# Altium project Main Controller.PrjPcb
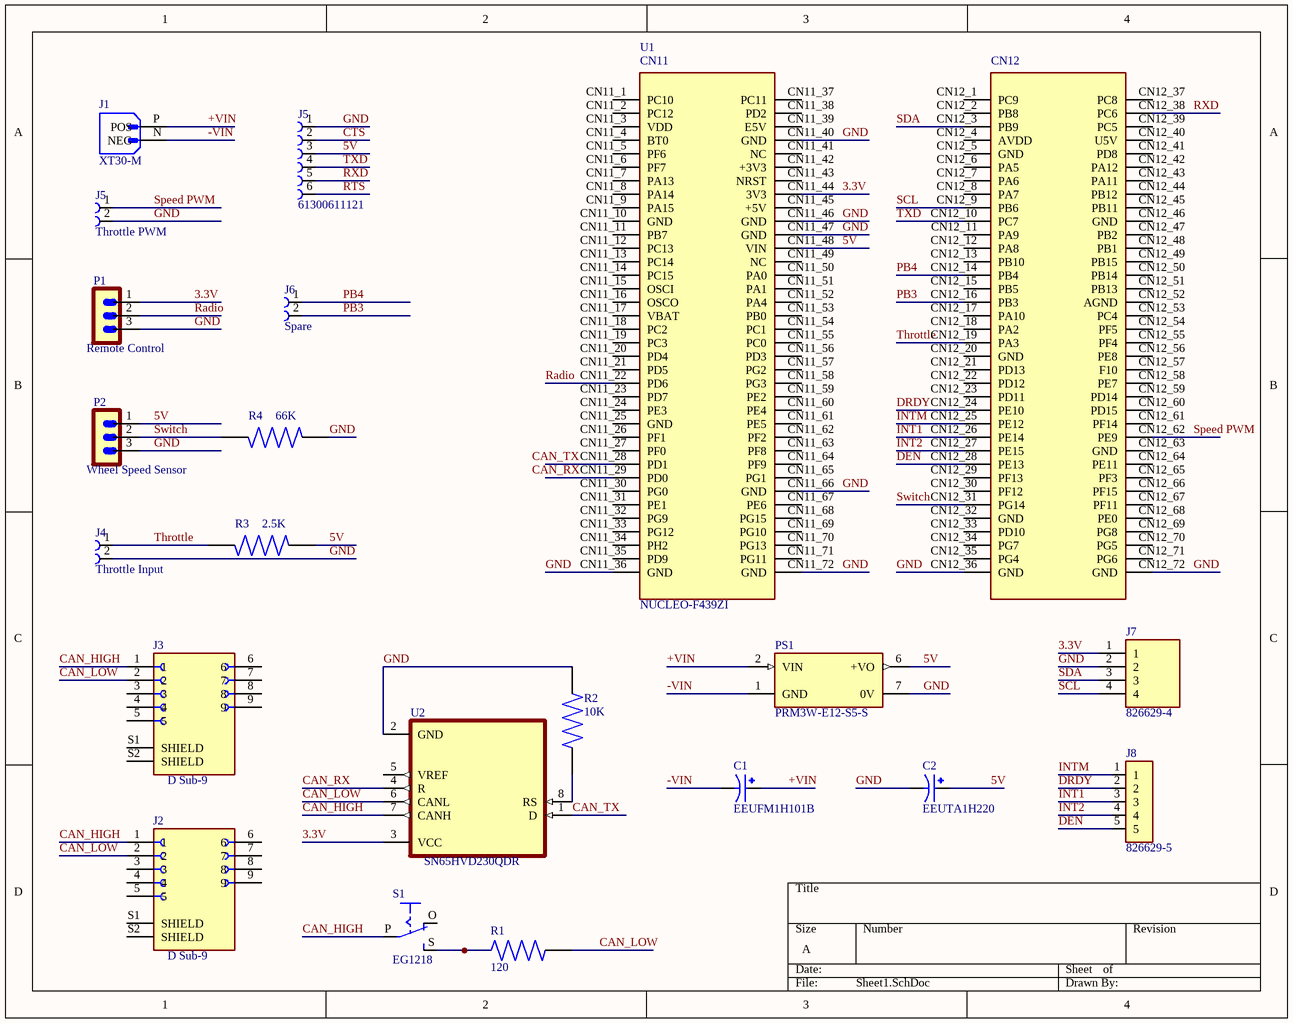
[diagram p0: Sheet1.SchDoc]
1 sheet, 21 parts. Net scope: global (net labels, ports and power ports of the same name join across sheets).
Board file: Main Controller.PcbDoc

## Sheet Sheet1.SchDoc
size A; SheetNumber: 1; SheetTotal: 1

### Parts
(Parts that share a designator on the sheet are numbered #1, #2 ... from top to bottom, then left to right.)
C1  EEUFM1H101B  [CAPPRD500W60D800H1150]
C2  EEUTA1H220  [CAPPRD350W60D800H1150]
J1  XT30-M  [AMASS_XT60-M]
J2  D Sub-9  [ASSMANN_A-DF_09_A_KG-T2S]
J3  D Sub-9  [ASSMANN_A-DF_09_A_KG-T2S]
J4  Throttle Input  [691214110002]
J5#1  61300611121  [61300611121]
J5#2  Throttle PWM  [691214110002]
J6  Spare  [691214110002]
J7  826629-4  [TE_826629-4]
J8  826629-5  [TE_826629-5]
P1  Remote Control  [B3B-PH-K]
P2  Wheel Speed Sensor  [B3B-PH-K]
PS1  PRM3W-E12-S5-S  [CONV_PRM3W-E12-S5-S]
R1  120  [RESC3216X65N]
R2  10K  [RESC3216X65N]
R3  2.5K  [RESC3216X65N]
R4  66K  [RESC3216X65N]
S1  EG1218  [EG1218]
U1  NUCLEO-F439ZI  [Nucleo-F439ZI]
U2  SN65HVD230QDR  [SOIC127P599X175-8N]

### Nets
3.3V: J7.1 P1.1 U1.CN11_44(3V3) U2.3(VCC)
5V: C2.P J5#1.3 P2.1 PS1.6(+VO) R3.1 U1.CN11_48(VIN)
+VIN: C1.P J1.P(POS) PS1.2(VIN)
-VIN: C1.N J1.N(NEG) PS1.1(GND)
CAN_HIGH: J2.1 J3.1 S1.P U2.7(CANH)
CAN_LOW: J2.2 J3.2 R1.2 U2.6(CANL)
CAN_RX: U2.4(R)
CAN_TX: U2.1(D)
CTS: J5#1.2
DEN: J8.5 U1.CN12_28(PE13)
DRDY: J8.2 U1.CN12_24(PE10)
GND: C2.N J4.2 J5#1.1 J5#2.2 J7.2 P1.3 P2.3 PS1.7(0V) R2.2 R4.1 U1.CN11_36(GND) U1.CN11_40(GND) U1.CN11_46(GND) U1.CN11_47(GND) U1.CN11_66(GND) U1.CN11_72(GND) U1.CN12_36(GND) U1.CN12_72(GND) U2.2(GND)
INT1: J8.3 U1.CN12_26(PE14)
INT2: J8.4 U1.CN12_27(PE15)
INTM: J8.1 U1.CN12_25(PE12)
PB3: J6.2 U1.CN12_16(PB3)
PB4: J6.1 U1.CN12_14(PB4)
Radio: P1.2 U1.CN11_22(PD6)
RTS: J5#1.6
RXD: J5#1.5 U1.CN12_38(PC6)
SCL: J7.4 U1.CN12_9(PB6)
SDA: J7.3 U1.CN12_3(PB9)
Speed PWM: J5#2.1 U1.CN12_62(PE9)
Switch: P2.2 R4.2 U1.CN12_31(PG14)
Throttle: J4.1 R3.2 U1.CN12_19(PA3)
TXD: J5#1.4 U1.CN12_10(PC7)
NetR1_1: R1.1 S1.S
NetR2_1: R2.1 U2.8(RS)

Not connected (* = marked no-connect by the designer): J2 3 4 5 6 7 8 9 S1(SHIELD) S2(SHIELD); J3 3 4 5 6 7 8 9 S1(SHIELD) S2(SHIELD); S1 O; U1 CN11_1(PC10) CN11_2(PC12) CN11_3(VDD) CN11_4(BT0) CN11_5(PF6) CN11_6(PF7) CN11_7(PA13) CN11_8(PA14) CN11_9(PA15) CN11_10(GND) CN11_11(PB7) CN11_12(PC13) CN11_13(PC14) CN11_14(PC15) CN11_15(OSCI) CN11_16(OSCO) CN11_17(VBAT) CN11_18(PC2) CN11_19(PC3) CN11_20(PD4) CN11_21(PD5) CN11_23(PD7) CN11_24(PE3) CN11_25(GND) CN11_26(PF1) CN11_27(PF0) CN11_28(PD1) CN11_29(PD0) CN11_30(PG0) CN11_31(PE1) CN11_32(PG9) CN11_33(PG12) CN11_34(PH2) CN11_35(PD9) CN11_37(PC11) CN11_38(PD2) CN11_39(E5V) CN11_41(NC) CN11_42(+3V3) CN11_43(NRST) CN11_45(+5V) CN11_49(NC) CN11_50(PA0) CN11_51(PA1) CN11_52(PA4) CN11_53(PB0) CN11_54(PC1) CN11_55(PC0) CN11_56(PD3) CN11_57(PG2) CN11_58(PG3) CN11_59(PE2) CN11_60(PE4) CN11_61(PE5) CN11_62(PF2) CN11_63(PF8) CN11_64(PF9) CN11_65(PG1) CN11_67(PE6) CN11_68(PG15) CN11_69(PG10) CN11_70(PG13) CN11_71(PG11) CN12_1(PC9) CN12_2(PB8) CN12_4(AVDD) CN12_5(GND) CN12_6(PA5) CN12_7(PA6) CN12_8(PA7) CN12_11(PA9) CN12_12(PA8) CN12_13(PB10) CN12_15(PB5) CN12_17(PA10) CN12_18(PA2) CN12_20(GND) CN12_21(PD13) CN12_22(PD12) CN12_23(PD11) CN12_29(PF13) CN12_30(PF12) CN12_32(GND) CN12_33(PD10) CN12_34(PG7) CN12_35(PG4) CN12_37(PC8) CN12_39(PC5) CN12_40(U5V) CN12_41(PD8) CN12_42(PA12) CN12_43(PA11) CN12_44(PB12) CN12_45(PB11) CN12_46(GND) CN12_47(PB2) CN12_48(PB1) CN12_49(PB15) CN12_50(PB14) CN12_51(PB13) CN12_52(AGND) CN12_53(PC4) CN12_54(PF5) CN12_55(PF4) CN12_56(PE8) CN12_57(F10) CN12_58(PE7) CN12_59(PD14) CN12_60(PD15) CN12_61(PF14) CN12_63(GND) CN12_64(PE11) CN12_65(PF3) CN12_66(PF15) CN12_67(PF11) CN12_68(PE0) CN12_69(PG8) CN12_70(PG5) CN12_71(PG6); U2 5(VREF)

### Notes on the sheet
- Labels drawn without touching a wire or pin: CAN_RX, CAN_TX
- (in symbol NUCLEO-F439ZI) CN11; CN12

### Library data of the parts
C1 = EEUFM1H101B: Cap Aluminum Lytic 100uF 50V 20% (8 X 11.5mm) Radial 5mm 870mA 3000h 105C Ammo Pack; MF: Panasonic; Package: RADIAL-2 Panasonic; MP: EEUFM1H101B; Check_prices: https://www.snapeda.com/parts/EEUFM1H101B/Panasonic/view-part/5783638/?ref=eda; Value: *; SnapEDA_Link: https://www.snapeda.com/parts/EEUFM1H101B/Panasonic/view-part/5783638/?ref=snap; Price: None; Availability: In Stock
C2 = EEUTA1H220: 22F 50V Aluminum Electrolytic Capacitors Radial, Can 2000 Hrs @ 125C; MP: EEU-TA1H220; MF: Panasonic; Check_prices: https://www.snapeda.com/parts/EEU-TA1H220/Panasonic/view-part/?ref=eda; Package: RADIAL-2 Panasonic; Price: None; Availability: In Stock; Purchase-URL: https://pricing.snapeda.com/search/part/EEU-TA1H220/?ref=eda; SnapEDA_Link: https://www.snapeda.com/parts/EEU-TA1H220/Panasonic/view-part/?ref=snap; Value: *
J1 = XT30-M: Plug; DC supply; XT60; male; PIN: 2; for cable; soldered; 30A; 500V; MP: XT60-M; MF: AMASS; Package: Package; Availability: Not in stock; SnapEDA_Link: https://www.snapeda.com/parts/XT60-M/AMASS/view-part/?ref=snap; Check_prices: https://www.snapeda.com/parts/XT60-M/AMASS/view-part/?ref=eda; Price: None; Value: *
J2 J3 = A-DF_09_A_KG-T2S: 9 Position D-Sub Receptacle, Female Sockets Connector; MF: Assmann WSW; MP: A-DF 09 A/KG-T2S; Value: *; Purchase-URL: https://pricing.snapeda.com/search/part/A-DF 09 A/KG-T2S/?ref=eda; Package: None; Check_prices: https://www.snapeda.com/parts/A-DF%2009%20A/KG-T2S/Assmann+WSW+Components/view-part/?ref=eda; Price: None; SnapEDA_Link: https://www.snapeda.com/parts/A-DF%2009%20A/KG-T2S/Assmann+WSW+Components/view-part/?ref=snap; Availability: In Stock
J4 J5#2 J6 = 691214110002: 2 Position Wire to Board Terminal Block Horizontal with Board 0.138 (3.50mm) Through Hole; MF: WÃ¼rth Elektronik; SnapEDA_Link: https://www.snapeda.com/parts/691214110002/Wurth+Elektronik/view-part/?ref=snap; Availability: In Stock; Price: None; Purchase-URL: https://pricing.snapeda.com/search/part/691214110002/?ref=eda; Check_prices: https://www.snapeda.com/parts/691214110002/Wurth+Elektronik/view-part/?ref=eda; Package: None; MP: 691214110002; Value: *
J5#1 = 61300611121: Connector Header Through Hole 6 position 0.100 (2.54mm); MF: WÃ¼rth Elektronik; Price: None; Value: *; Purchase-URL: https://pricing.snapeda.com/search/part/61300611121/?ref=eda; Check_prices: https://www.snapeda.com/parts/61300611121/Wurth+Elektronik/view-part/?ref=eda; Package: None; Availability: In Stock; SnapEDA_Link: https://www.snapeda.com/parts/61300611121/Wurth+Elektronik/view-part/?ref=snap; MP: 61300611121
J7 = 826629-4: Conn Unshrouded Header HDR 4 POS 2.54mm Solder ST Thru-Hole Automotive Carton; MF: TE Connectivity; MP: 826629-4; Package: None; Price: None; Availability: Unavailable; EU_RoHS_Compliance: Compliant; SnapEDA_Link: https://www.snapeda.com/parts/826629-4/TE%20Connectivity%20AMP%20Connectors/view-part/891255/?ref=snap; Value: *; TE_purchase_URL: https://www.te.com/usa-en/product-826629-4.html?te_bu=Cor&te_type=disp&te_campaign=seda_glo_cor-seda-global-disp-prtnr-fy19-seda-model-bom-cta_sma-317_1&elqCampaignId=32493
J8 = 826629-5: Board-To-Board Connector, AMPMODU MOD II Series, Through Hole, Header, 5, 2.54 mm; Number_of_Positions: 5; Centerline_Pitch: 2.54 mm[.1 in]; MF: TE Connectivity; Product_Type: Connector; Availability: Unavailable; EU_RoHS_Compliance: Compliant; Package: None; MP: 826629-5; TE_purchase_URL: https://www.te.com/usa-en/product-826629-5.html?te_bu=Cor&te_type=disp&te_campaign=seda_glo_cor-seda-global-disp-prtnr-fy19-seda-model-bom-cta_sma-317_1&elqCampaignId=32493; SnapEDA_Link: https://www.snapeda.com/parts/826629-5/TE%20Connectivity%20AMP%20Connectors/view-part/905319/?ref=snap; Price: None; Value: *
P1 P2 = B3B-PH-K: Connector Header Through Hole 3 position 0.079 (2.00mm); MF: JST; Package: None; Value: *; MP: B3B-PH-K; Price: None; SnapEDA_Link: https://www.snapeda.com/parts/B3B-PH-K/JST/view-part/2895696/?ref=snap; Check_prices: https://www.snapeda.com/parts/B3B-PH-K/JST/view-part/2895696/?ref=eda; Availability: No availability data
PS1 = PRM3W-E12-S5-S: MF: {'manufacturer': u'CUI'}; MP: PRM3W-E12-S5-S; Package: None; Price: None; Availability: Unavailable; Value: *
R1-R4 = KTR18EZPF9530: Package: None; Price: None; Value: *; MP: KTR18EZPF9530; Availability: Unavailable
S1 = EG1218: <b>SLIDING SWITCH</b><p> 0.1" spacing through hole, vertical SPDT slide switch <p>http://www.ladyada.net/library/pcb/eaglelibrary.html</p>; Package: None; Availability: Unavailable; Value: *; MP: EG1218; Price: None
U1 = NUCLEO-F439ZI: STM32F429ZI, mbed-Enabled Development Nucleo-144 STM32F4 ARMÂ® CortexÂ®-M4 MCU 32-Bit Embedded Evaluation Board; MP: NUCLEO-F429ZI; Value: *; Availability: Unavailable; Package: None; Price: None
U2 = SN65HVD230QDR: 3.3-V CAN Transceiver with Standby Mode 8-SOIC -40 to 125; MF: Texas Instruments; Package: SOIC-8 Texas Instruments; Price: None; MP: SN65HVD230QDR; Availability: Good; Value: *; Check_prices: https://www.snapeda.com/parts/SN65HVD230QDR/Texas%20Instruments/view-part/1178075/?ref=eda; Purchase-URL: https://pricing.snapeda.com/search/part/SN65HVD230QDR/?ref=eda; SnapEDA_Link: https://www.snapeda.com/parts/SN65HVD230QDR/Texas%20Instruments/view-part/1178075/?ref=snap